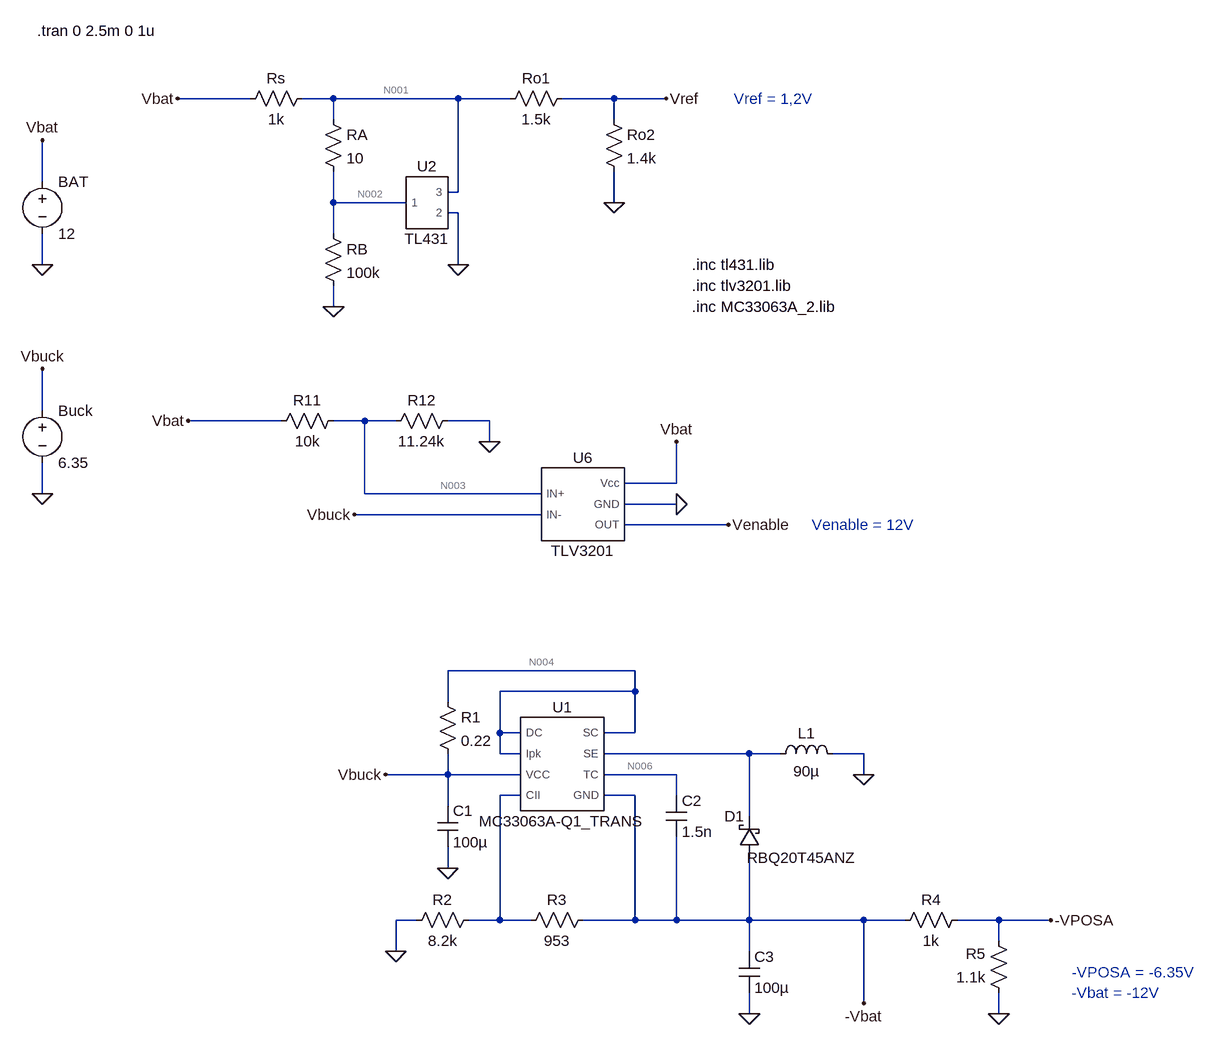
[diagram p0: schematic Support4.asc]
Support4.asc, the LTspice schematic file:
Version 4
SHEET 1 2324 2468
WIRE 304 -64 192 -64
WIRE 432 -64 384 -64
WIRE 624 -64 432 -64
WIRE 704 -64 624 -64
WIRE 864 -64 784 -64
WIRE 944 -64 864 -64
WIRE 432 -32 432 -64
WIRE 864 -32 864 -64
WIRE -16 64 -16 0
WIRE 624 80 624 -64
WIRE 624 80 608 80
WIRE 432 96 432 48
WIRE 544 96 432 96
WIRE 864 96 864 48
WIRE 624 112 608 112
WIRE 432 144 432 96
WIRE -16 192 -16 144
WIRE 624 192 624 112
WIRE 432 256 432 224
WIRE -16 416 -16 352
WIRE 352 432 208 432
WIRE 480 432 432 432
WIRE 528 432 480 432
WIRE 672 432 608 432
WIRE 672 464 672 432
WIRE 960 528 960 464
WIRE 960 528 880 528
WIRE -16 544 -16 496
WIRE 480 544 480 432
WIRE 752 544 480 544
WIRE 960 560 880 560
WIRE 752 576 464 576
WIRE 1040 592 880 592
WIRE 896 816 608 816
WIRE 896 848 896 816
WIRE 896 848 688 848
WIRE 608 864 608 816
WIRE 688 912 688 848
WIRE 720 912 688 912
WIRE 896 912 896 848
WIRE 896 912 848 912
WIRE 688 944 688 912
WIRE 720 944 688 944
WIRE 1072 944 848 944
WIRE 1120 944 1072 944
WIRE 1248 944 1200 944
WIRE 608 976 608 944
WIRE 608 976 512 976
WIRE 720 976 608 976
WIRE 960 976 848 976
WIRE 1248 976 1248 944
WIRE 720 1008 688 1008
WIRE 896 1008 848 1008
WIRE 960 1008 960 976
WIRE 608 1024 608 976
WIRE 1072 1040 1072 944
WIRE 608 1120 608 1088
WIRE 560 1200 528 1200
WIRE 688 1200 688 1008
WIRE 688 1200 640 1200
WIRE 736 1200 688 1200
WIRE 896 1200 896 1008
WIRE 896 1200 816 1200
WIRE 960 1200 960 1072
WIRE 960 1200 896 1200
WIRE 1072 1200 1072 1104
WIRE 1072 1200 960 1200
WIRE 1248 1200 1072 1200
WIRE 1312 1200 1248 1200
WIRE 1456 1200 1392 1200
WIRE 1536 1200 1456 1200
WIRE 1456 1232 1456 1200
WIRE 528 1248 528 1200
WIRE 1072 1248 1072 1200
WIRE 1248 1328 1248 1200
WIRE 1072 1344 1072 1312
WIRE 1456 1344 1456 1312
FLAG -16 192 0
FLAG 432 256 0
FLAG 624 192 0
FLAG 944 -64 Vref
FLAG 864 96 0
FLAG 192 -64 Vbat
FLAG -16 0 Vbat
FLAG 464 576 Vbuck
FLAG 672 464 0
FLAG 960 560 0
FLAG 960 464 Vbat
FLAG -16 544 0
FLAG -16 352 Vbuck
FLAG 1040 592 Venable
FLAG 208 432 Vbat
FLAG 608 1120 0
FLAG 528 1248 0
FLAG 1248 976 0
FLAG 1072 1344 0
FLAG 1536 1200 -VPOSA
FLAG 512 976 Vbuck
FLAG 1456 1344 0
FLAG 1248 1328 -Vbat
SYMBOL res 288 -48 R270
WINDOW 0 32 56 VTop 2
WINDOW 3 0 56 VBottom 2
SYMATTR InstName Rs
SYMATTR Value 1k
SYMBOL res 416 128 R0
SYMATTR InstName RB
SYMATTR Value 100k
SYMBOL voltage -16 48 R0
WINDOW 123 0 0 Left 0
WINDOW 39 0 0 Left 0
SYMATTR InstName BAT
SYMATTR Value 12
SYMBOL res 688 -48 R270
WINDOW 0 32 56 VTop 2
WINDOW 3 0 56 VBottom 2
SYMATTR InstName Ro1
SYMATTR Value 1.5k
SYMBOL res 848 -48 R0
SYMATTR InstName Ro2
SYMATTR Value 1.4k
SYMBOL res 416 -48 R0
SYMATTR InstName RA
SYMATTR Value 10
SYMBOL voltage -16 400 R0
SYMATTR InstName Buck
SYMATTR Value 6.35
SYMBOL res 448 416 R90
WINDOW 0 0 56 VBottom 2
WINDOW 3 32 56 VTop 2
SYMATTR InstName R11
SYMATTR Value 10k
SYMBOL res 624 416 R90
WINDOW 0 0 56 VBottom 2
WINDOW 3 32 56 VTop 2
SYMATTR InstName R12
SYMATTR Value 11.24k
SYMBOL res 592 848 R0
SYMATTR InstName R1
SYMATTR Value 0.22
SYMBOL cap 592 1024 R0
SYMATTR InstName C1
SYMATTR Value 100µ
SYMBOL res 656 1184 R90
WINDOW 0 0 56 VBottom 2
WINDOW 3 32 56 VTop 2
SYMATTR InstName R2
SYMATTR Value 8.2k
SYMBOL res 832 1184 R90
WINDOW 0 0 56 VBottom 2
WINDOW 3 32 56 VTop 2
SYMATTR InstName R3
SYMATTR Value 953
SYMBOL cap 944 1008 R0
SYMATTR InstName C2
SYMATTR Value 1.5n
SYMBOL ind 1104 960 R270
WINDOW 0 32 56 VTop 2
WINDOW 3 5 56 VBottom 2
SYMATTR InstName L1
SYMATTR Value 90µ
SYMBOL cap 1056 1248 R0
SYMATTR InstName C3
SYMATTR Value 100µ
SYMBOL schottky 1088 1104 R180
WINDOW 0 24 64 Left 2
WINDOW 3 -149 0 Left 2
SYMATTR InstName D1
SYMATTR Value RBQ20T45ANZ
SYMATTR Description Zener Diode
SYMATTR Type zener
SYMBOL res 1408 1184 R90
WINDOW 0 0 56 VBottom 2
WINDOW 3 32 56 VTop 2
SYMATTR InstName R4
SYMATTR Value 1k
SYMBOL res 1472 1328 R180
WINDOW 0 36 76 Left 2
WINDOW 3 36 40 Left 2
SYMATTR InstName R5
SYMATTR Value 1.1k
SYMBOL tl431 576 96 R0
SYMATTR InstName U2
SYMBOL TLV3201 816 560 R0
SYMATTR InstName U6
SYMBOL MC33063A-Q1_TRANS 784 960 R0
SYMATTR InstName U1
TEXT -24 -168 Left 2 !.tran 0 2.5m 0 1u
TEXT 1048 -64 Left 2 ;Vref = 1,2V
TEXT 1168 592 Left 2 ;Venable = 12V
TEXT 1568 1280 Left 2 ;-VPOSA = -6.35V
TEXT 1568 1312 Left 2 ;-Vbat = -12V
TEXT 984 192 Left 2 !.inc tl431.lib
TEXT 984 224 Left 2 !.inc tlv3201.lib
TEXT 984 256 Left 2 !.inc MC33063A_2.lib

The netlist it stands for:
* Support4.asc
Rs Vbat N001 1k
RB N002 0 100k
V§BAT Vbat 0 12
Ro1 N001 Vref 1.5k
Ro2 Vref 0 1.4k
RA N001 N002 10
V§Buck Vbuck 0 6.35
R11 N003 Vbat 10k
R12 0 N003 11.24k
R1 N004 Vbuck 0.22
C1 Vbuck 0 100µ
R2 N007 0 8.2k
R3 -Vbat N007 953
C2 N006 -Vbat 1.5n
L1 N005 0 90µ
C3 -Vbat 0 100µ
D1 -Vbat N005 RBQ20T45ANZ
R4 -VPOSA -Vbat 1k
R5 0 -VPOSA 1.1k
XU2 0 N001 N002 TL431  ; pins 2 3 1
XU6 N003 Vbuck Vbat 0 Venable TLV3201  ; pins IN+ IN- Vcc GND OUT
XU1 N007 N004 -Vbat N004 N004 N005 N006 Vbuck MC33063A-Q1_TRANS  ; pins CII DC GND Ipk SC SE TC VCC
.model D D
.lib standard.dio
.tran 0 2.5m 0 1u
* Vref = 1,2V
* Venable = 12V
* -VPOSA = -6.35V
* -Vbat = -12V
.inc tl431.lib
.inc tlv3201.lib
.inc MC33063A_2.lib
.lib C:\users\Denise.Viltes\OneDrive - Toyota Argentina S.A\Documentos\dce-g5-proyecto_integrador-main\dce-g5-proyecto_integrador-main\Checkpoint 4\Support\Librerias support\tl431.lib
.lib C:\users\Denise.Viltes\OneDrive - Toyota Argentina S.A\Documentos\dce-g5-proyecto_integrador-main\dce-g5-proyecto_integrador-main\Checkpoint 4\Support\Librerias support\tlv3201.lib
.lib C:\users\Denise.Viltes\OneDrive - Toyota Argentina S.A\Documentos\dce-g5-proyecto_integrador-main\dce-g5-proyecto_integrador-main\Checkpoint 4\Support\Librerias support\MC33063A_2.lib
.backanno
.end

* Results of the author's LTspice run, read from the files saved beside the schematic
* Operating Point, zero values left out:
*   V(vbat) = 12 V
*   V(n001) = 2.495 V
*   V(n002) = 2.494 V
*   V(vref) = 1.204 V
*   V(vbuck) = 6.35 V
*   V(n003) = 6.35 V
*   V(n004) = 6.35 V
*   V(n006) = -67.1 mV
*   V(venable) = 6 V
*   I(L1) = 12.7 pA
*   I(Rs) = 9.505 mA
*   I(Rb) = 24.94 µA
*   I(Ro1) = 860.3 µA
*   I(Ro2) = 860.3 µA
*   I(Ra) = 27.02 µA
*   I(R11) = -565 µA
*   I(R12) = -565 µA
*   I(R1) = -12.7 pA
*   I(Bat) = -10.11 mA
*   I(Buck) = -13.69 pA
*   Ix(u2:2) = -8.62 mA
*   Ix(u2:3) = 8.618 mA
*   Ix(u2:1) = 2.079 µA
*   Ix(u6:VCC) = 40 µA
*   Ix(u6:GND) = -40 µA
*   Ix(u1:DC) = 6.352 pA
*   Ix(u1:SC) = 6.35 pA
*   Ix(u1:SE) = -12.7 pA